# Altium schematic sheet Sensors.SchDoc
size A4
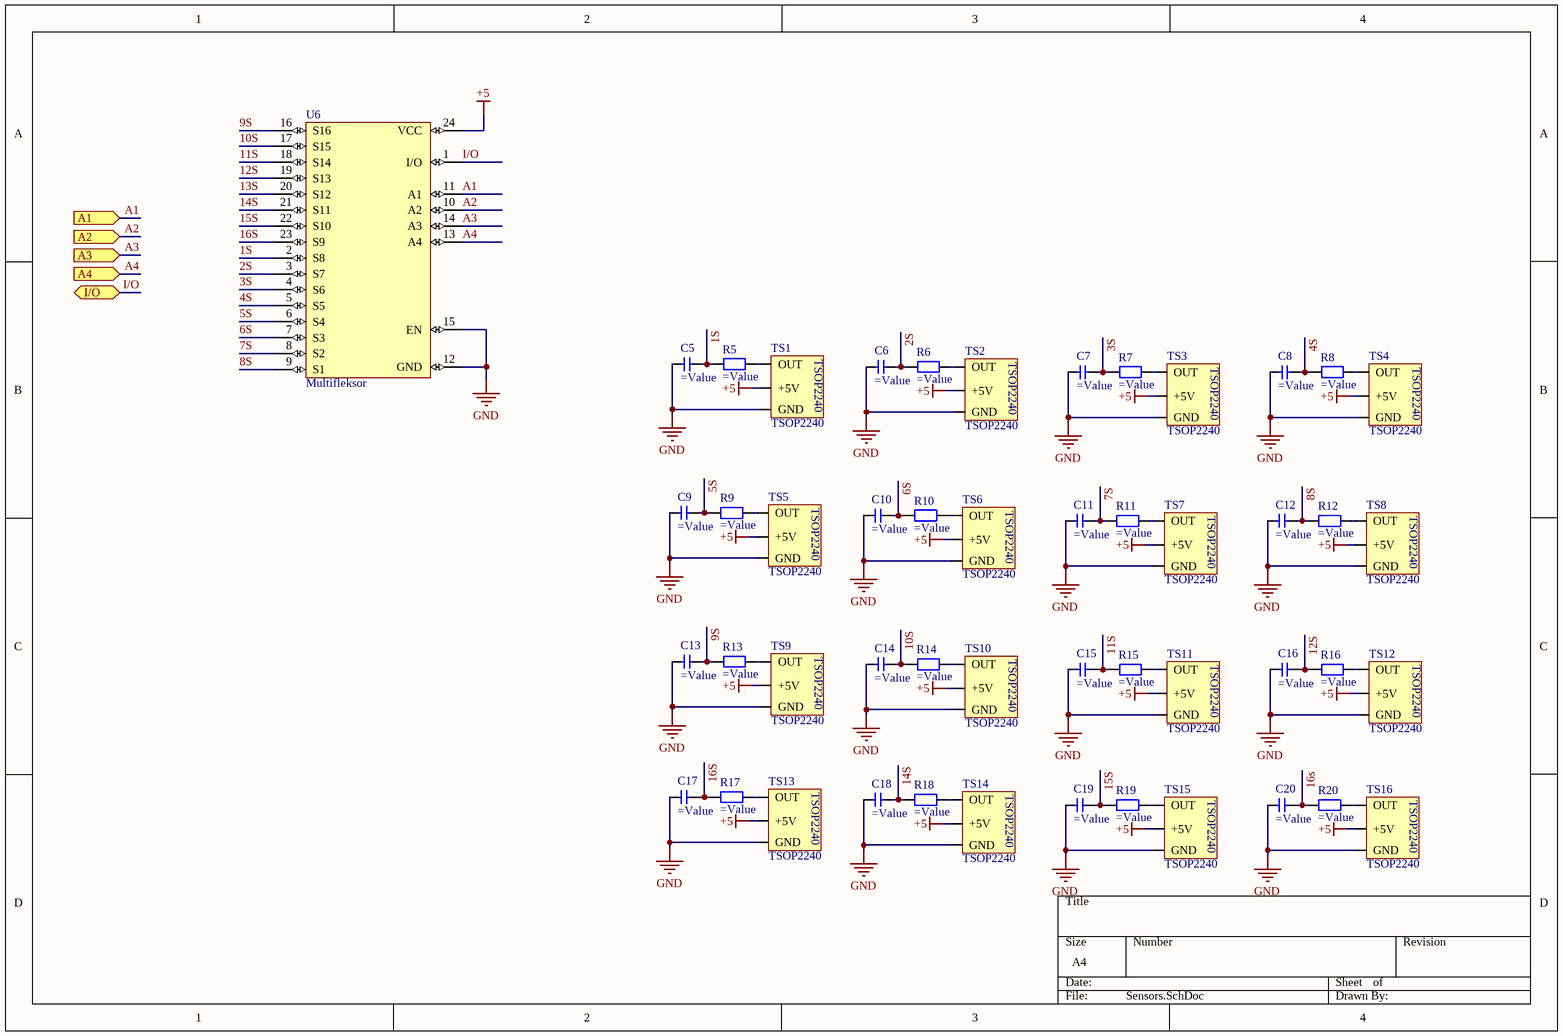
[diagram p0: Sensors.SchDoc]

## Parts
C5  (no value)  [cap0805]
C6  (no value)  [cap0805]
C7  (no value)  [cap0805]
C8  (no value)  [cap0805]
C9  (no value)  [cap0805]
C10  (no value)  [cap0805]
C11  (no value)  [cap0805]
C12  (no value)  [cap0805]
C13  (no value)  [cap0805]
C14  (no value)  [cap0805]
C15  (no value)  [cap0805]
C16  (no value)  [cap0805]
C17  (no value)  [cap0805]
C18  (no value)  [cap0805]
C19  (no value)  [cap0805]
C20  (no value)  [cap0805]
R5  (no value)  [res0805]
R6  (no value)  [res0603]
R7  (no value)  [res0805]
R8  (no value)  [res0805]
R9  (no value)  [res0805]
R10  (no value)  [res0805]
R11  (no value)  [res0805]
R12  (no value)  [res0805]
R13  (no value)  [res0805]
R14  (no value)  [res0805]
R15  (no value)  [res0805]
R16  (no value)  [res0805]
R17  (no value)  [res0805]
R18  (no value)  [res0805]
R19  (no value)  [res0805]
R20  (no value)  [res0805]
TS1  TSOP2240  [TSOP2240]
TS2  TSOP2240  [TSOP2240]
TS3  TSOP2240  [TSOP2240]
TS4  TSOP2240  [TSOP2240]
TS5  TSOP2240  [TSOP2240]
TS6  TSOP2240  [TSOP2240]
TS7  TSOP2240  [TSOP2240]
TS8  TSOP2240  [TSOP2240]
TS9  TSOP2240  [TSOP2240]
TS10  TSOP2240  [TSOP2240]
TS11  TSOP2240  [TSOP2240]
TS12  TSOP2240  [TSOP2240]
TS13  TSOP2240  [TSOP2240]
TS14  TSOP2240  [TSOP2240]
TS15  TSOP2240  [TSOP2240]
TS16  TSOP2240  [TSOP2240]
U6  Multifleksor  [SSOP-24]

## Ports
A1 (in), A2 (in), A3 (in), A4 (in), I/O (bidir)

## Nets
+5: TS1.2(+5V) TS2.2(+5V) TS3.2(+5V) TS4.2(+5V) TS5.2(+5V) TS6.2(+5V) TS7.2(+5V) TS8.2(+5V) TS9.2(+5V) TS10.2(+5V) TS11.2(+5V) TS12.2(+5V) TS13.2(+5V) TS14.2(+5V) TS15.2(+5V) TS16.2(+5V) U6.24(VCC)
GND: C5.1 C6.1 C7.1 C8.1 C9.1 C10.1 C11.1 C12.1 C13.1 C14.1 C15.1 C16.1 C17.1 C18.1 C19.1 C20.1 TS1.3(GND) TS2.3(GND) TS3.3(GND) TS4.3(GND) TS5.3(GND) TS6.3(GND) TS7.3(GND) TS8.3(GND) TS9.3(GND) TS10.3(GND) TS11.3(GND) TS12.3(GND) TS13.3(GND) TS14.3(GND) TS15.3(GND) TS16.3(GND) U6.12(GND) U6.15(EN)
1S: C5.2 R5.1 U6.2(S8)
2S: C6.2 R6.1 U6.3(S7)
3S: C7.2 R7.1 U6.4(S6)
4S: C8.2 R8.1 U6.5(S5)
5S: C9.2 R9.1 U6.6(S4)
6S: C10.2 R10.1 U6.7(S3)
7S: C11.2 R11.1 U6.8(S2)
8S: C12.2 R12.1 U6.9(S1)
9S: C13.2 R13.1 U6.16(S16)
10S: C14.2 R14.1 U6.17(S15)
11S: C15.2 R15.1 U6.18(S14)
12S: C16.2 R16.1 U6.19(S13)
13S: U6.20(S12)
14S: C18.2 R18.1 U6.21(S11)
15S: C19.2 R19.1 U6.22(S10)
16S: C17.2 C20.2 R17.1 R20.1 U6.23(S9)
A1: U6.11(A1) ; port A1
A2: U6.10(A2) ; port A2
A3: U6.14(A3) ; port A3
A4: U6.13(A4) ; port A4
I/O: U6.1(I/O) ; port I/O
NetR5_2: R5.2 TS1.1(OUT)
NetR6_2: R6.2 TS2.1(OUT)
NetR7_2: R7.2 TS3.1(OUT)
NetR8_2: R8.2 TS4.1(OUT)
NetR9_2: R9.2 TS5.1(OUT)
NetR10_2: R10.2 TS6.1(OUT)
NetR11_2: R11.2 TS7.1(OUT)
NetR12_2: R12.2 TS8.1(OUT)
NetR13_2: R13.2 TS9.1(OUT)
NetR14_2: R14.2 TS10.1(OUT)
NetR15_2: R15.2 TS11.1(OUT)
NetR16_2: R16.2 TS12.1(OUT)
NetR17_2: R17.2 TS13.1(OUT)
NetR18_2: R18.2 TS14.1(OUT)
NetR19_2: R19.2 TS15.1(OUT)
NetR20_2: R20.2 TS16.1(OUT)

## Library data of the parts
C5-C20 = Cap SMD
R5-R20 = Resistor SMD